# Altium schematic sheet 2_wiring drawing.SchDoc: POWER & IGON
size A2; ApprovedBy: Approved By; CheckedBy: Sky Ma; DrawnBy: Jack; Address1: 1; Address2: 2; Address3: 3; Address4: 4; DocumentNumber: 04-TE-42-4015-0PA-A; Revision: B; SheetNumber: 3; SheetTotal: 6; SheetSize: A2; CheckedByDate: 2022-11-19; DrawByDate: 2022-11-19; SiteName: EMS TD Huangpu; : Record=PageOptions|CenterHorizontal=True|CenterVertical=True|PrintScale=0.73|XCorrection=1.00|YCorrection=1.00|PrintKind=0|BorderSize=5000000|LeftOffset=0|BottomOffset=0|Orientation=2|PaperLength=1000|PaperWidth=1000|Scale=100|PaperSource=15|PrintQuality=1200|MediaType=1|DitherType=10|PaperKind=A3|Pr; PageSetup: Record=PageOptions|CenterHorizontal=True|CenterVertical=True|PrintScale=0.52|XCorrection=1.00|YCorrection=1.00|PrintKind=0|BorderSize=5000000|LeftOffset=0|BottomOffset=0|Orientation=2|PaperLength=1000|PaperWidth=1000|Scale=100|PaperSource=15|PrintQuality=1200|MediaType=1|DitherType=10|PaperKind=A4|PrintScaleMode=1; ProjectName: 19205_BMW CCU DDR PCBA FT fixture wiring
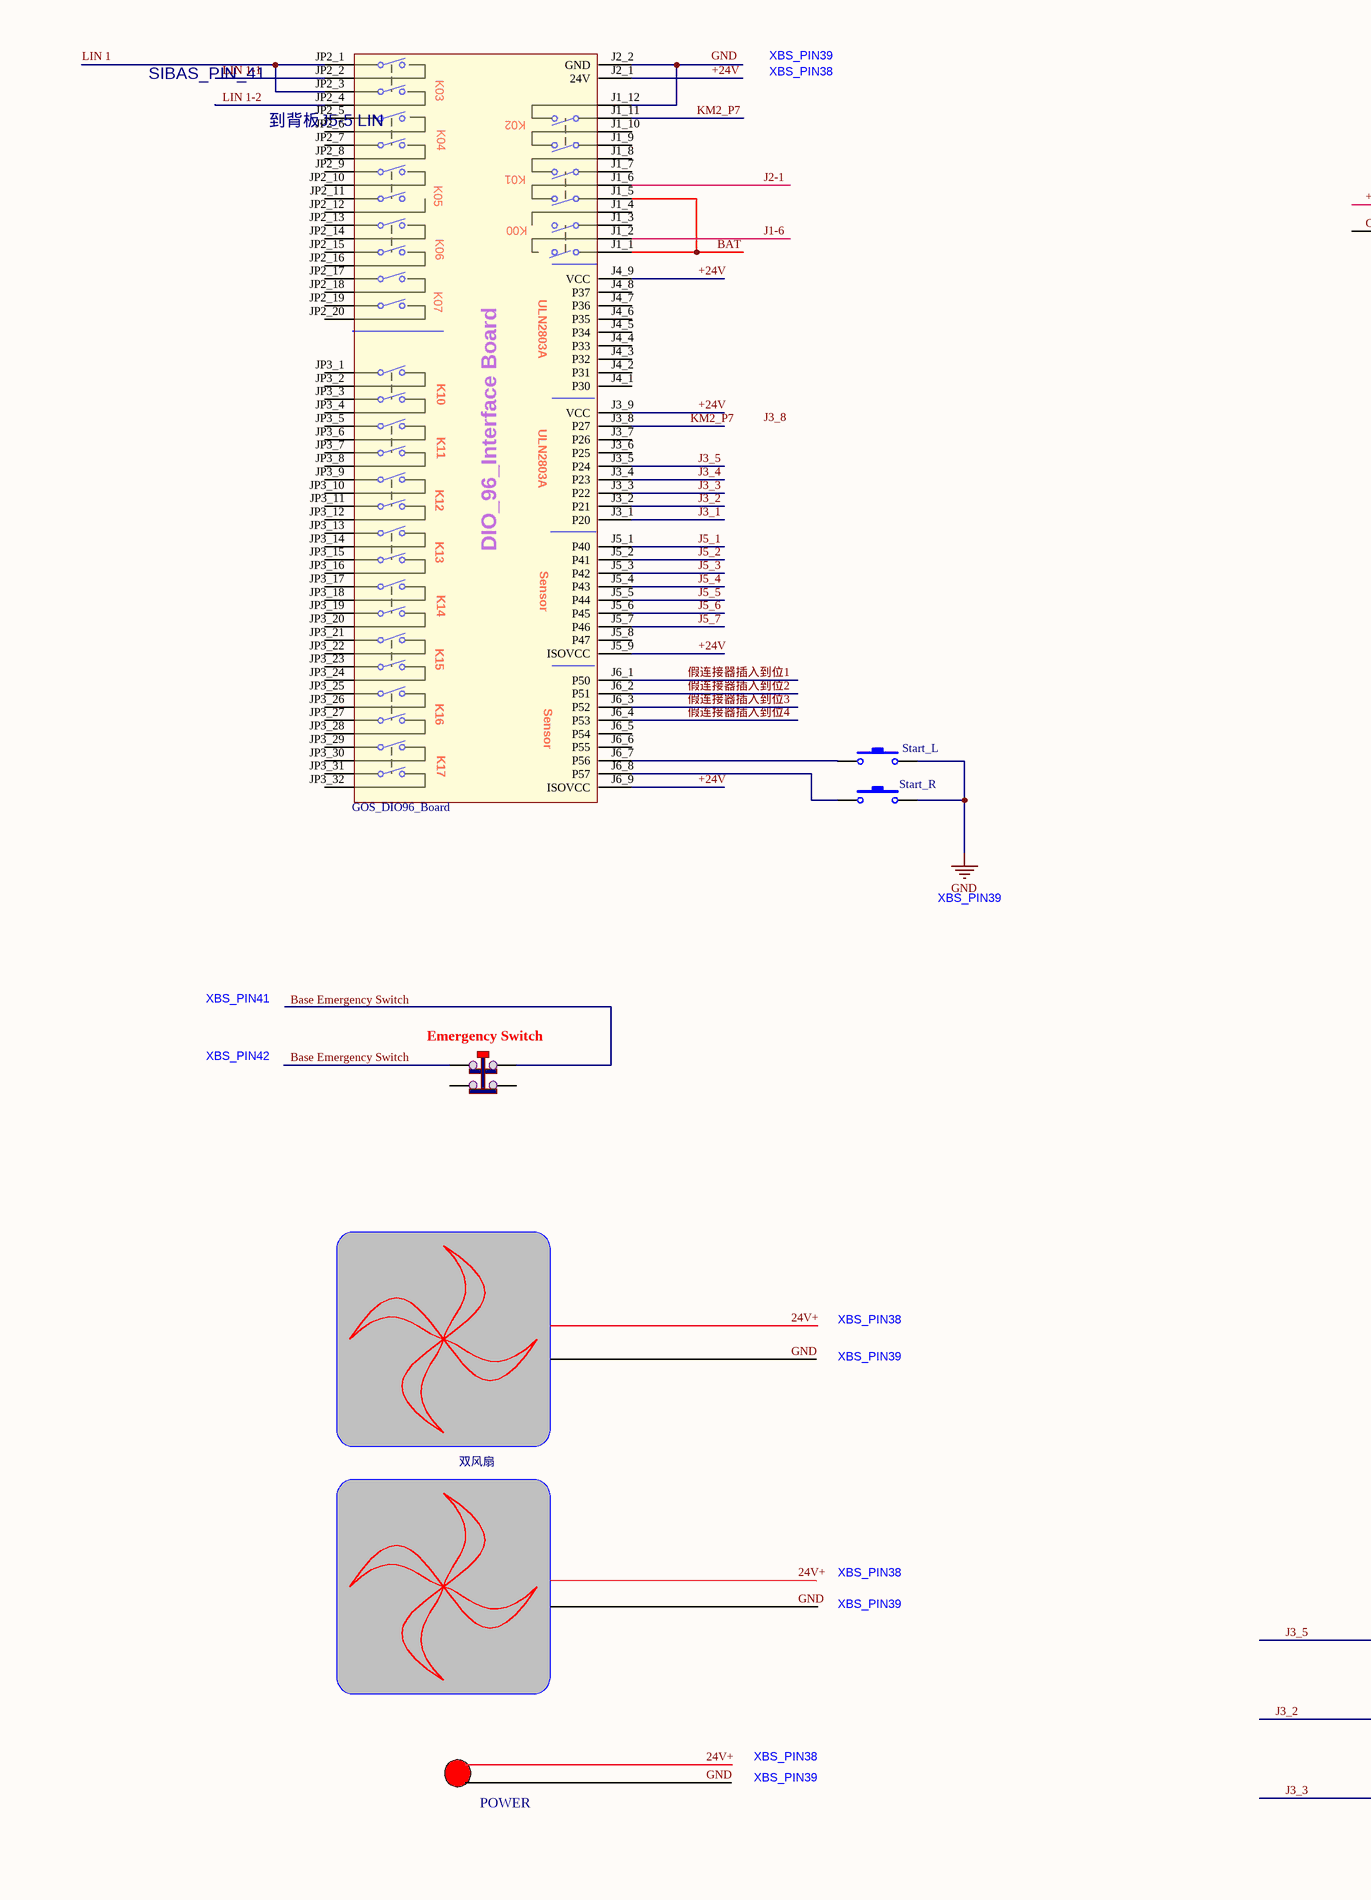
[diagram p0: 2_wiring drawing.SchDoc, left]
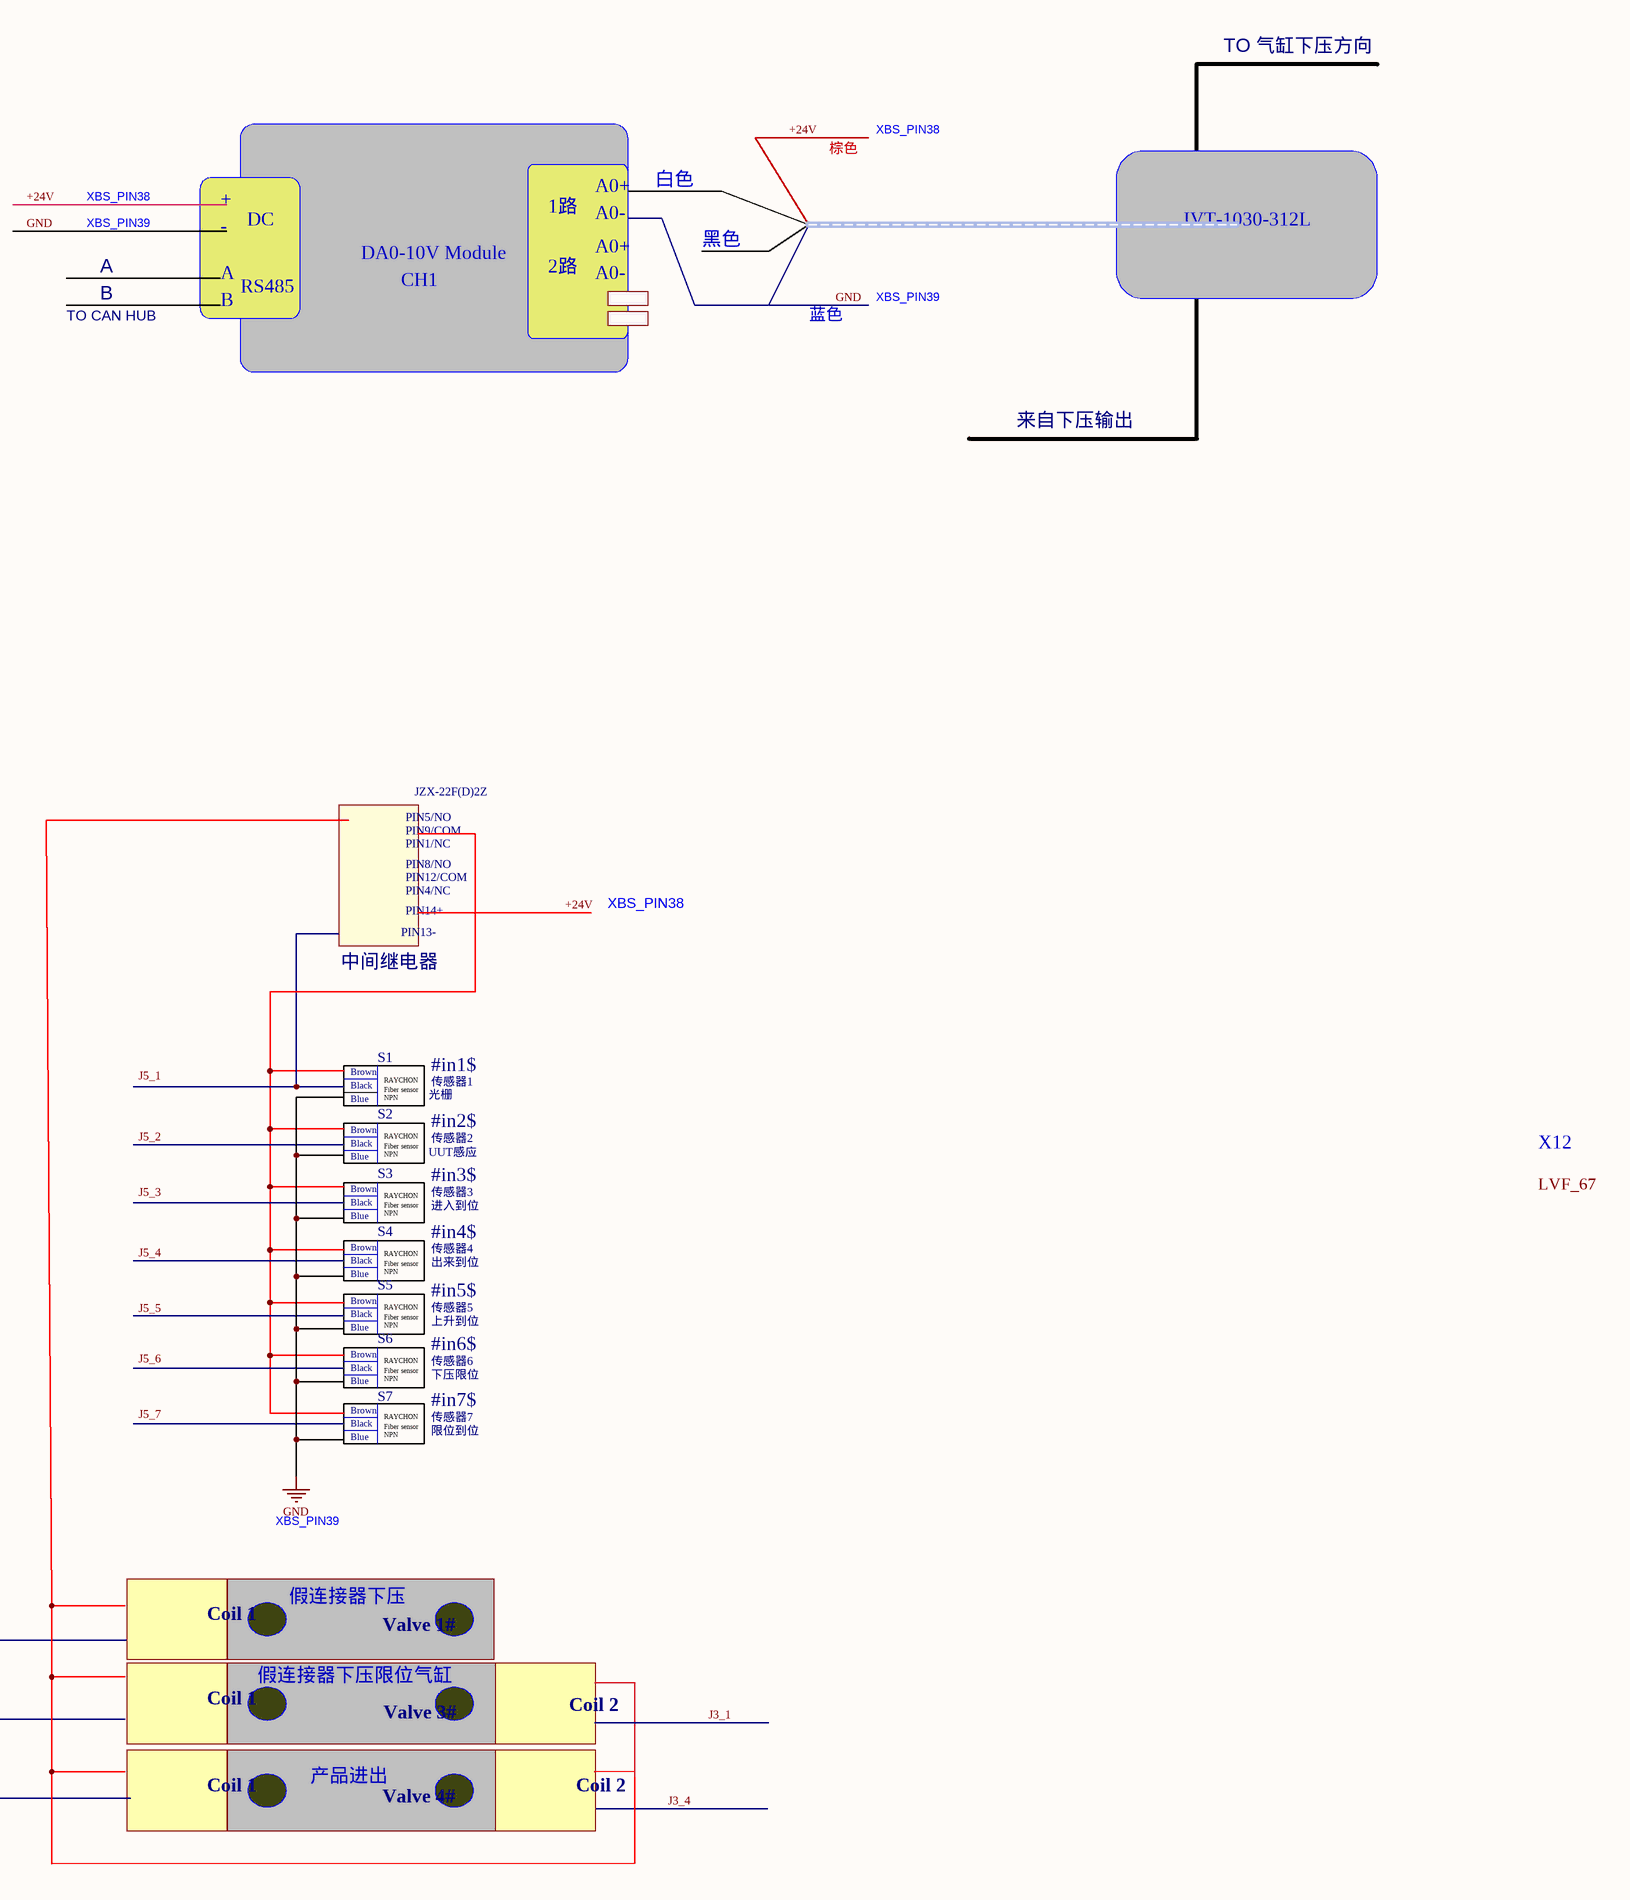
[diagram p1: 2_wiring drawing.SchDoc, right]

## Parts
B1  GOS_DIO96_Board
EMSW?  Emergency Switch
Start_L  (no value)
Start_R  (no value)

## Nets
GND: Start_L.2 Start_R.2
+24V: B1.J2_1(24V) B1.J3_9(VCC) B1.J4_9(VCC) B1.J5_9(ISOVCC) B1.J6_9(ISOVCC)
Base Emergency Switch: EMSW?.1
BAT: B1.J1_1 B1.J1_5
J1-6: B1.J1_2
J2-1: B1.J1_6
J3_1: B1.J3_1(P20)
J3_2: B1.J3_2(P21)
J3_3: B1.J3_3(P22)
J3_4: B1.J3_4(P23)
J3_5: B1.J3_5(P24)
J5_1: B1.J5_1(P40)
J5_2: B1.J5_2(P41)
J5_3: B1.J5_3(P42)
J5_4: B1.J5_4(P43)
J5_5: B1.J5_5(P44)
J5_6: B1.J5_6(P45)
J5_7: B1.J5_7(P46)
KM2_P7: B1.J1_11 B1.J3_8(P27)
LIN 1: B1.JP2_1(JP2_51) B1.JP2_3(JP2_53)
LIN 1-1: B1.JP2_2(JP2_52)
LIN 1-2: B1.JP2_4(JP2_54)
假连接器插入到位1: B1.J6_1(P50)
假连接器插入到位2: B1.J6_2(P51)
假连接器插入到位3: B1.J6_3(P52)
假连接器插入到位4: B1.J6_4(P53)
NetB1_J1_12: B1.J1_12 B1.J2_2(GND)
NetB1_J6_7: B1.J6_7(P56) Start_L.1
NetB1_J6_8: B1.J6_8(P57) Start_R.1

Not connected (* = marked no-connect by the designer): B1 1(COMMON) J1_3 J1_4 J1_7 J1_8 J1_9 J1_10 J3_6(P25) J3_7(P26) J4_1(P30) J4_2(P31) J4_3(P32) J4_4(P33) J4_5(P34) J4_6(P35) J4_7(P36) J4_8(P37) J5_8(P47) J6_5(P54) J6_6(P55) JP2_5(JP2_55) JP2_6(JP2_56) JP2_7(JP2_57) JP2_8(JP2_58) JP2_9(JP2_59) JP2_10(JP2_60) JP2_11(JP2_61) JP2_12(JP2_62) JP2_13(JP2_63) JP2_14(JP2_64) JP2_15(JP2_65) JP2_16(JP2_66) JP2_17(JP2_67) JP2_18(JP2_68) JP2_19(JP2_69) JP2_20(JP2_70) JP3_1(JP2_51) JP3_2(JP2_52) JP3_3(JP2_53) JP3_4(JP2_54) JP3_5(JP2_55) JP3_6(JP2_56) JP3_7(JP2_57) JP3_8(JP2_58) JP3_9(JP2_59) JP3_10(JP2_60) JP3_11(JP2_61) JP3_12(JP2_62) JP3_13(JP2_63) JP3_14(JP2_64) JP3_15(JP2_65) JP3_16(JP2_66) JP3_17(JP2_67) JP3_18(JP2_68) JP3_19(JP2_69) JP3_20(JP2_70) JP3_21(JP2_71) JP3_22(JP2_72) JP3_23(JP2_73) JP3_24(JP2_74) JP3_25(JP2_75) JP3_26(JP2_76) JP3_27(JP2_77) JP3_28(JP2_78) JP3_29(JP2_79) JP3_30(JP2_80) JP3_31(JP2_81) JP3_32(JP2_82); EMSW? 2 3 4

## Notes on the sheet
- TO 气缸下压方向
- SIBAS_PIN_41
- 到背板J5-5 LIN
- A0+
- 白色
- 棕色
- +
- -
- DC
- 1路
- A0-
- 黑色
- IVT-1030-312L
- TO CAN HUB
- A
- B
- RS485
- DA0-10V Module
- CH1
- 2路
- 蓝色
- 来自下压输出
- PIN1/NC
- PIN5/NO
- PIN9/COM
- JZX-22F(D)2Z
- PIN4/NC
- PIN8/NO
- PIN12/COM
- PIN14+
- 中间继电器
- PIN13-
- S1
- Brown
- Black
- Blue
- S2
- RAYCHON
- Fiber sensor
- NPN
- 光栅
- #in1$
- #in2$
- 传感器1
- S3
- UUT感应
- 传感器3
- 传感器2
- #in3$
- X12
- S4
- 进入到位
- 传感器4
- #in4$
- S5
- 出来到位
- 传感器5
- #in5$
- 上升到位
- S6
- 传感器6
- #in6$
- 下压限位
- S7
- 传感器7
- #in7$
- 限位到位
- 双风扇
- Coil 1
- 假连接器下压
- Valve 1#
- 假连接器下压限位气缸
- Valve 3#
- Coil 2
- 产品进出
- POWER
- Valve 4#
- Labels drawn without touching a wire or pin: 24V+, +24V, Base Emergency Switch, GND, J3_8, J5_1, J5_3, J5_5, J5_6, J5_7, LVF_67, XBS_PIN38, XBS_PIN39, XBS_PIN41, XBS_PIN42
- Document Number:
- Rev:
- Project Name:
- Drawn By:
- Date:
- Titile:
- Checked By:
- Sheet:
- Of
- (in symbol GOS_DIO96_Board) K03; K02; K04; K01; K05; K00; K06; K07; ULN2803A; K10; K11; K12; K13; DIO_96_Interface Board; Sensor; K14; K15; K16; K17

## Library data of the parts
EMSW? = SW_NC2
Start_L Start_R = SW_NO: Switch; Published: 24-Mar-1999; LatestRevisionDate: 17-Jul-2002; LatestRevisionNote: Re-released for DXP Platform.; PackageReference: SPST-2; Publisher: Altium Limited